# Altium schematic sheet Sheet1.SchDoc
size A; SheetNumber: 1; SheetTotal: 1
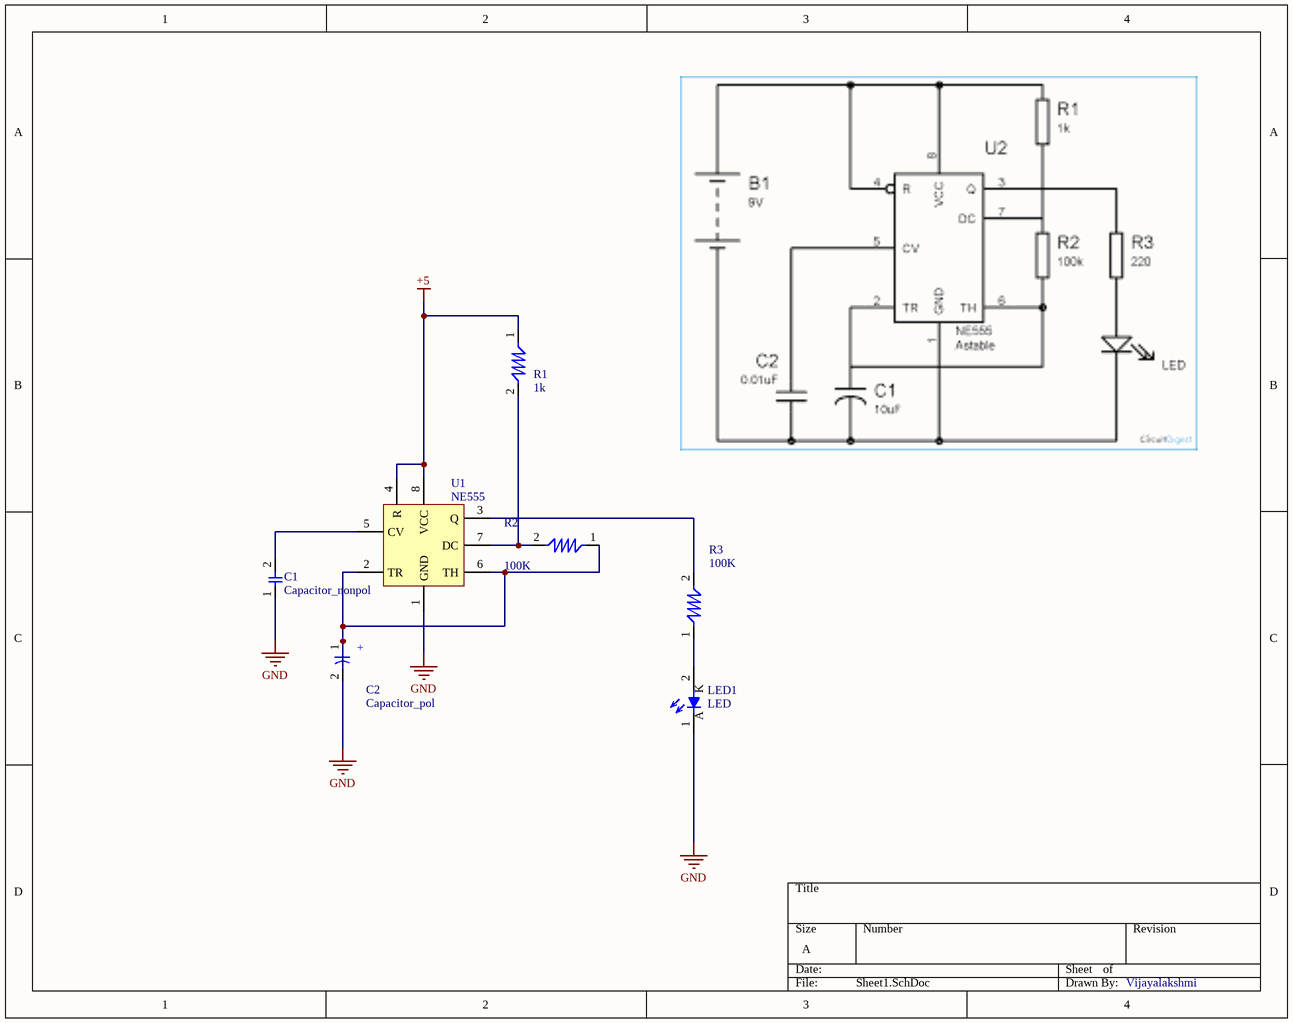
[diagram p0: Sheet1.SchDoc]

## Parts
C1  Capacitor_nonpol  [CAPACITOR]
C2  Capacitor_pol  [CAPACITOR]
LED1  LED  [LED]
R1  1k  [restsror]
R2  100K  [restsror]
R3  100K  [restsror]
U1  NE555  [IC]

## Nets
+5: R1.1 U1.4(R) U1.8(VCC)
GND: C1.1 C2.2(-) LED1.1(A(+)) U1.1(GND)
NetC1_2: C1.2 U1.5(CV)
NetC2_1: C2.1(+) R2.1 U1.2(TR) U1.6(TH)
NetLED1_2: LED1.2(K(-)) R3.1
NetR1_2: R1.2 R2.2 U1.7(DC)
NetR3_2: R3.2 U1.3(Q)

## Notes on the sheet
- Vijayalakshmi
- (in symbol LED) K; A

## Library data of the parts
R1 = 1K/0.1W: 1 kOhms ±1% 0.1W, 1/10W Chip Resistor 0603 (1608 Metric) Automotive AEC-Q200 Thick Film; Part number: RMCF0603FT1K00; Manufacturer: Stackpole Electronics Inc
R2 R3 = 100K/0.1W
C2 = Capacitor_pol: Package: 0402; Parameter 2: *